# Altium schematic sheet Zavrsni.SchDoc
size A4
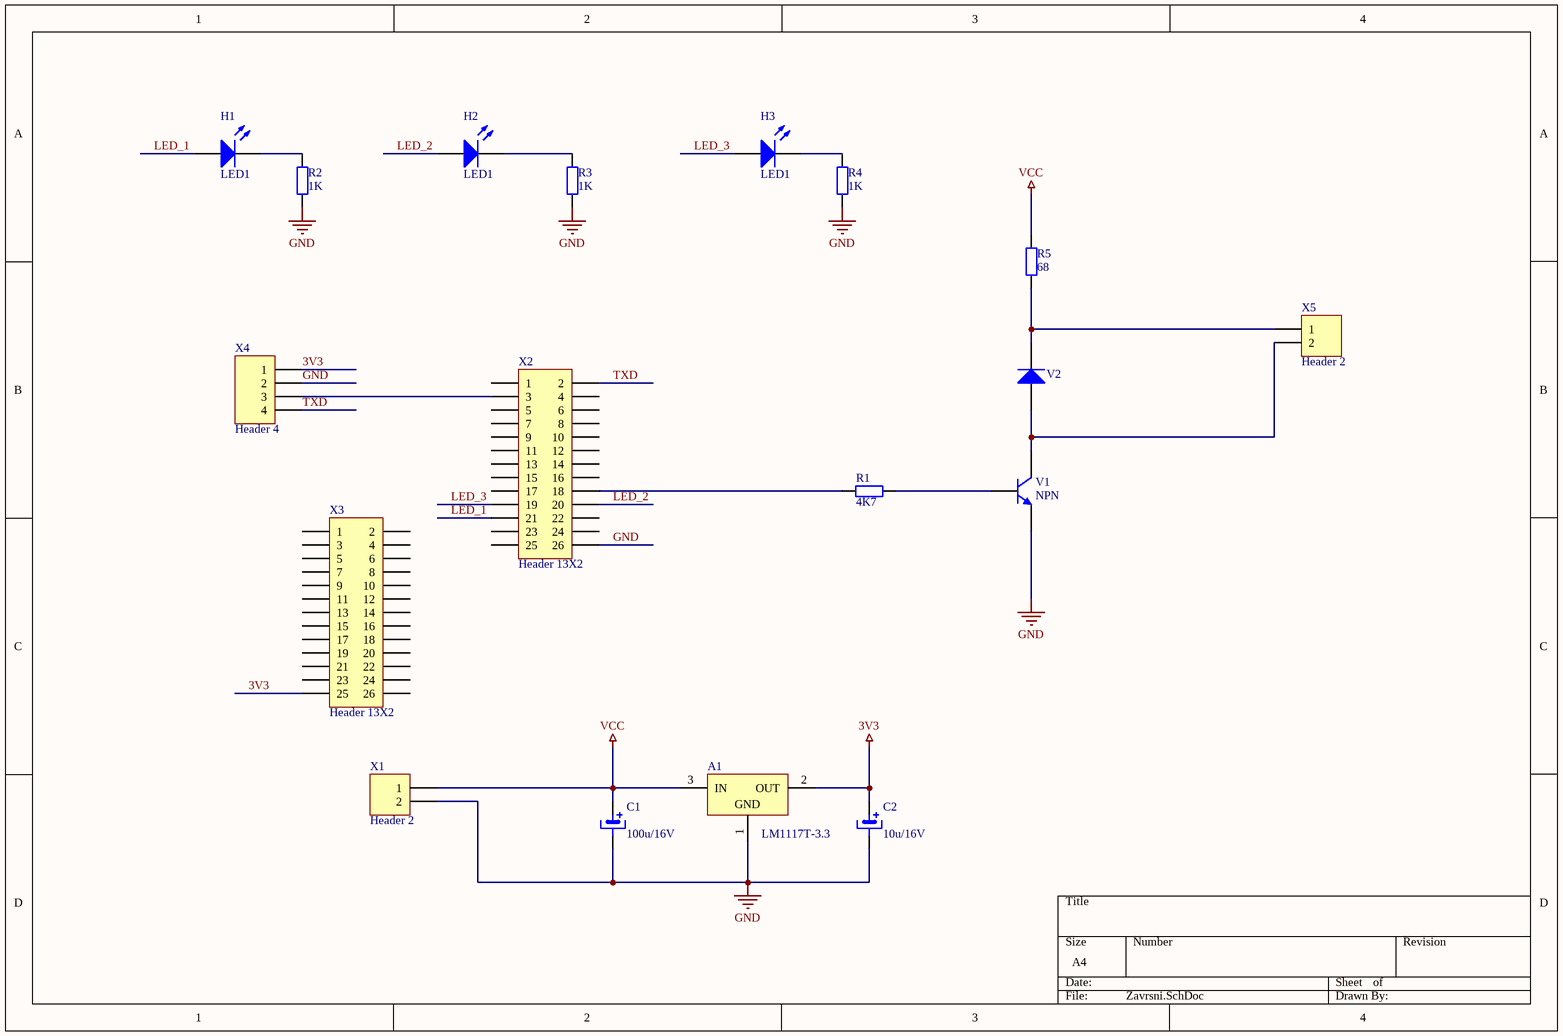
[diagram p0: Zavrsni.SchDoc]

## Parts
A1  LM1117T-3.3  [T03B]
C1  100u/16V  [CAPPR2-5x6.8]
C2  10u/16V  [CAPPR2-5x6.8]
H1  LED1  [LED dioda]
H2  LED1  [LED dioda]
H3  LED1  [LED dioda]
R1  4K7  [AXIAL-0.4]
R2  1K  [AXIAL-0.4]
R3  1K  [AXIAL-0.4]
R4  1K  [AXIAL-0.4]
R5  68  [AXIAL-0.4]
V1  NPN  [TO-226-AA]
V2  Diode 1N4004  [DO-41]  (value not drawn)
X1  Header 2  [HDR1X2]
X2  Header 13X2  [HDR2X13]
X3  Header 13X2  [HDR2X13]
X4  Header 4  [HDR1X4]
X5  Header 2  [HDR1X2]

## Nets
3V3: A1.2(OUT) C2.1 X3.25 X4.1
GND: A1.1(GND) C1.2 C2.2 R2.1 R3.1 R4.1 V1.3(E) X1.2 X2.26 X4.2
VCC: A1.3(IN) C1.1 R5.2 X1.1
LED_1: H1.1(A) X2.21
LED_2: H2.1(A) X2.20
LED_3: H3.1(A) X2.19
TXD: X2.2 X4.4
NetH1_2: H1.2(K) R2.2
NetH2_2: H2.2(K) R3.2
NetH3_2: H3.2(K) R4.2
NetR1_1: R1.1 X2.18
NetR1_2: R1.2 V1.2(B)
NetR5_1: R5.1 V2.2(K) X5.1
NetV1_1: V1.1(C) V2.1(A) X5.2
NetX2_3: X2.3 X4.3

Not connected (* = marked no-connect by the designer): X2 1 4 5 6 7 8 9 10 11 12 13 14 15 16 17 22 23 24 25; X3 1 2 3 4 5 6 7 8 9 10 11 12 13 14 15 16 17 18 19 20 21 22 23 24 26

## Library data of the parts
A1 = LM1117T-3.3: 800mA Low-Dropout Linear Regulator, 3-pin TO-220; Manufacturer: National Semiconductor; PackageTopMarking: NSUZXYTTE#*LM1117T*3.3; PowerWise: N; CompType: LDO IC; Published: 4-Dec-2008; DatasheetVersion: Apr-2006; PackageVersion: revL, Jan-1992; PackageReference: T03B; Publisher: Altium Limited; PackageDescription: TO-220, Molded, 3 Lead, Straight; Supplier 1: Farnell; Supplier Part Number 1: 9485813; PartNumber: LM1117T-3.3; RoHS: N; PinCount: 3; ComponentLink1Description: LM1117 Datasheet; ComponentLink1URL: http://www.national.com/ds/LM/LM1117.pdf; ComponentLink2Description: LM1117 Web Page; ComponentLink2URL: http://www.national.com/pf/LM/LM1117.html; ComponentLink3Description: T03B Package Page; ComponentLink3URL: http://www.national.com/packaging/folders/t03b.html
C1 C2 = Elko: Electrolytic capacitor
  C1: Value: 100u/16V
  C2: Value: 10u/16V
H1 = LED1: LED zelena; Published: 8-Jun-2000; LatestRevisionDate: 08-Jul-2005; LatestRevisionNote: Mech Layer 1 removed.; PackageReference: LED-1; Publisher: Altium Limited; PackageDescription: LED; 2 Leads
H2 = LED1: LED žuta; Published: 8-Jun-2000; LatestRevisionDate: 08-Jul-2005; LatestRevisionNote: Mech Layer 1 removed.; PackageReference: LED-1; Publisher: Altium Limited; PackageDescription: LED; 2 Leads
H3 = LED1: LED crvena; Published: 8-Jun-2000; LatestRevisionDate: 08-Jul-2005; LatestRevisionNote: Mech Layer 1 removed.; PackageReference: LED-1; Publisher: Altium Limited; PackageDescription: LED; 2 Leads
R1-R5 = Res2: Resistor; Published: 8-Jun-2000; LatestRevisionDate: 17-Jul-2002; LatestRevisionNote: Re-released for DXP Platform.; PackageReference: AXIAL-0.4; Publisher: Altium Limited; PackageDescription: Axial Device, Thru-Hole; 2 Leads; 0.4 in Pin Spacing
  R1: Value: 4K7
  R2-R4: Value: 1K
  R5: Value: 68
V1 = NPN: NPN Bipolar Transistor; Published: 8-Jun-2000; LatestRevisionDate: 17-Jul-2002; LatestRevisionNote: Re-released for DXP Platform.; PackageReference: TO-226-AA; Publisher: Altium Limited; PackageDescription: TO, Flat Index; 3 In-Line, Axial Leads; Body Dia. 4.8mm; Leads 0.55 x 0.51 mm (max); Code_JEDEC: TO-226-AA
V2 = Diode 1N4004: 1 Amp General Purpose Rectifier; Published: 8-Jun-2000; LatestRevisionDate: 17-Jul-2002; LatestRevisionNote: Re-released for DXP Platform.; DatasheetVersion: 1998; PackageVersion: Aug-1999; PackageReference: DO-41; Publisher: Altium Limited; PackageDescription: Diode, Axial; Body 5.2 x 2.7 mm (LxDia. max), Lead Dia. 0.86 mm (max); Code_JEDEC: DO-204-AL; ComponentLink1Description: Manufacturer Link; ComponentLink1URL: http://www.fairchildsemi.com/; ComponentLink2Description: Datasheet; ComponentLink2URL: http://www.fairchildsemi.com/ds/1N%2F1N4001.pdf
X1 X5 = Header 2: Header, 2-Pin; LatestRevisionDate: 17-Jul-2002; LatestRevisionNote: Re-released for DXP Platform.; Publisher: Altium Limited
X2 X3 = Header 13X2: Header, 13-Pin, Dual row; LatestRevisionDate: 17-Jul-2002; LatestRevisionNote: Re-released for DXP Platform.; Publisher: Altium Limited
X4 = Header 4: Header, 4-Pin; LatestRevisionDate: 17-Jul-2002; LatestRevisionNote: Re-released for DXP Platform.; Publisher: Altium Limited